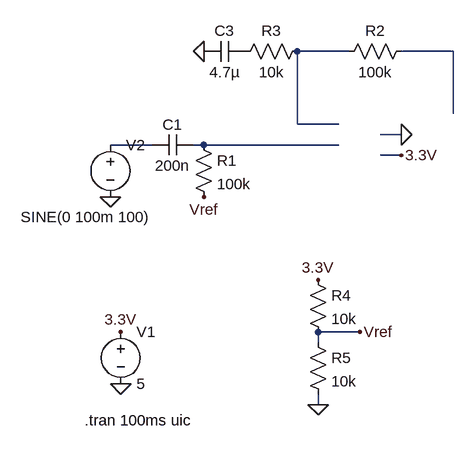
[diagram p0: schematic Entrada_ADC.asc]
Entrada_ADC.asc, the LTspice schematic file:
Version 4
SHEET 1 880 680
WIRE 128 64 48 64
WIRE 288 64 208 64
WIRE 288 160 288 64
WIRE 48 176 48 64
WIRE 112 176 48 176
WIRE 208 192 176 192
WIRE -176 208 -240 208
WIRE -96 208 -112 208
WIRE 112 208 -96 208
WIRE 208 224 176 224
WIRE 144 496 80 496
WIRE 80 512 80 496
WIRE 80 608 80 592
FLAG -96 64 0
FLAG -224 576 0
FLAG -224 496 3.3V
FLAG 80 608 0
FLAG 80 416 3.3V
FLAG 144 496 Vref
FLAG -96 288 Vref
FLAG -240 288 0
FLAG 208 224 3.3V
FLAG 208 192 0
SYMBOL cap -112 192 R90
WINDOW 0 0 32 VBottom 2
WINDOW 3 32 32 VTop 2
SYMATTR InstName C1
SYMATTR Value 200n
SYMBOL res -112 192 R0
SYMATTR InstName R1
SYMATTR Value 100k
SYMBOL res 224 48 R90
WINDOW 0 0 56 VBottom 2
WINDOW 3 32 56 VTop 2
SYMATTR InstName R2
SYMATTR Value 100k
SYMBOL res 64 48 R90
WINDOW 0 0 56 VBottom 2
WINDOW 3 32 56 VTop 2
SYMATTR InstName R3
SYMATTR Value 10k
SYMBOL cap -96 48 M90
WINDOW 0 0 32 VBottom 2
WINDOW 3 32 32 VTop 2
SYMATTR InstName C3
SYMATTR Value 4.7µ
SYMBOL voltage -224 480 R0
WINDOW 123 0 0 Left 0
WINDOW 39 0 0 Left 0
SYMATTR InstName V1
SYMATTR Value 5
SYMBOL res 64 400 R0
SYMATTR InstName R4
SYMATTR Value 10k
SYMBOL res 64 496 R0
SYMATTR InstName R5
SYMATTR Value 10k
SYMBOL voltage -240 192 R0
WINDOW 3 -138 127 Left 2
WINDOW 123 0 0 Left 0
WINDOW 39 0 0 Left 0
SYMATTR InstName V2
SYMATTR Value SINE(0 100m 100)
TEXT -280 632 Left 2 !.tran 100ms uic

The netlist it stands for:
* Entrada_ADC.asc
C1 N004 N003 200n
R1 N004 Vref 100k
R2 N002 N001 100k
R3 N001 P001 10k
C3 0 P001 4.7µ
V1 3.3V 0 5
R4 3.3V Vref 10k
R5 Vref 0 10k
V2 N003 0 SINE(0 100m 100)
.tran 100ms uic
.backanno
.end